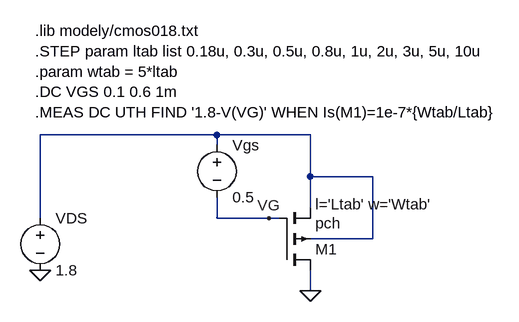
[diagram p0: schematic P2-mos.asc]
P2-mos.asc, the LTspice schematic file:
Version 4
SHEET 1 1628 680
WIRE 80 64 -192 64
WIRE 224 64 80 64
WIRE 80 80 80 64
WIRE 224 128 224 64
WIRE 320 128 224 128
WIRE 224 176 224 128
WIRE -192 192 -192 64
WIRE 80 192 80 160
WIRE 160 192 80 192
WIRE 176 192 160 192
WIRE 320 224 320 128
WIRE 320 224 224 224
WIRE 224 304 224 272
FLAG 224 304 0
FLAG -192 272 0
FLAG 160 192 VG
SYMBOL voltage 80 64 R0
WINDOW 123 0 0 Left 0
WINDOW 39 0 0 Left 0
SYMATTR InstName Vgs
SYMATTR Value 0.5
SYMBOL voltage -192 176 R0
WINDOW 123 0 0 Left 0
WINDOW 39 0 0 Left 0
SYMATTR InstName VDS
SYMATTR Value 1.8
SYMBOL pmos4 176 272 M180
WINDOW 123 56 101 Left 2
SYMATTR Value2 l='Ltab' w='Wtab'
SYMATTR InstName M1
SYMATTR Value pch
TEXT -200 -96 Left 2 !.lib modely/cmos018.txt\n.STEP param ltab list 0.18u, 0.3u, 0.5u, 0.8u, 1u, 2u, 3u, 5u, 10u\n.param wtab = 5*ltab\n.DC VGS 0.1 0.6 1m\n.MEAS DC UTH FIND '1.8-V(VG)' WHEN Is(M1)=1e-7*{Wtab/Ltab}

The netlist it stands for:
* P2-mos.asc
Vgs N001 VG 0.5
VDS N001 0 1.8
M1 0 VG N001 N001 pch l='Ltab' w='Wtab'
.model NMOS NMOS
.model PMOS PMOS
.lib standard.mos
.lib modely/cmos018.txt
.STEP param ltab list 0.18u, 0.3u, 0.5u, 0.8u, 1u, 2u, 3u, 5u, 10u
.param wtab = 5*ltab
.DC VGS 0.1 0.6 1m
.MEAS DC UTH FIND '1.8-V(VG)' WHEN Is(M1)=1e-7*{Wtab/Ltab}
.backanno
.end

* Results of the author's LTspice run, read from the files saved beside the schematic
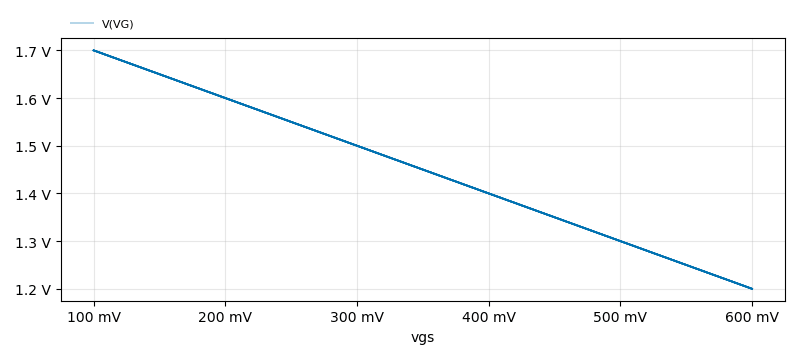
[diagram p1: DC transfer characteristic of P2-mos.asc, plotted from the saved traces]
* DC transfer characteristic, 9 runs:
*   V(VG) [ltab=1.8e-07]: 1.7 V at vgs=100 mV, 1.2 V at vgs=600 mV, min 1.2 V, max 1.7 V
*   V(VG) [ltab=3e-07]: 1.7 V at vgs=100 mV, 1.2 V at vgs=600 mV, min 1.2 V, max 1.7 V
*   V(VG) [ltab=5e-07]: 1.7 V at vgs=100 mV, 1.2 V at vgs=600 mV, min 1.2 V, max 1.7 V
*   V(VG) [ltab=8e-07]: 1.7 V at vgs=100 mV, 1.2 V at vgs=600 mV, min 1.2 V, max 1.7 V
*   V(VG) [ltab=1e-06]: 1.7 V at vgs=100 mV, 1.2 V at vgs=600 mV, min 1.2 V, max 1.7 V
*   V(VG) [ltab=2e-06]: 1.7 V at vgs=100 mV, 1.2 V at vgs=600 mV, min 1.2 V, max 1.7 V
*   V(VG) [ltab=3e-06]: 1.7 V at vgs=100 mV, 1.2 V at vgs=600 mV, min 1.2 V, max 1.7 V
*   V(VG) [ltab=5e-06]: 1.7 V at vgs=100 mV, 1.2 V at vgs=600 mV, min 1.2 V, max 1.7 V
* From the log:
*   Measurement: uth
*     step  (1.8-v(vg))  at
*        1  0.450782  0.450782
*        2  0.449915  0.449915
*        3  0.446555  0.446555
*        4  0.439249  0.439249
*        5  0.435497  0.435497
*        6  0.426509  0.426509
*        7  0.423538  0.423538
*        8  0.421494  0.421494
*        9  0.420673  0.420673